# Altium schematic sheet Nixie_Embedded_Controller.SchDoc
size A4
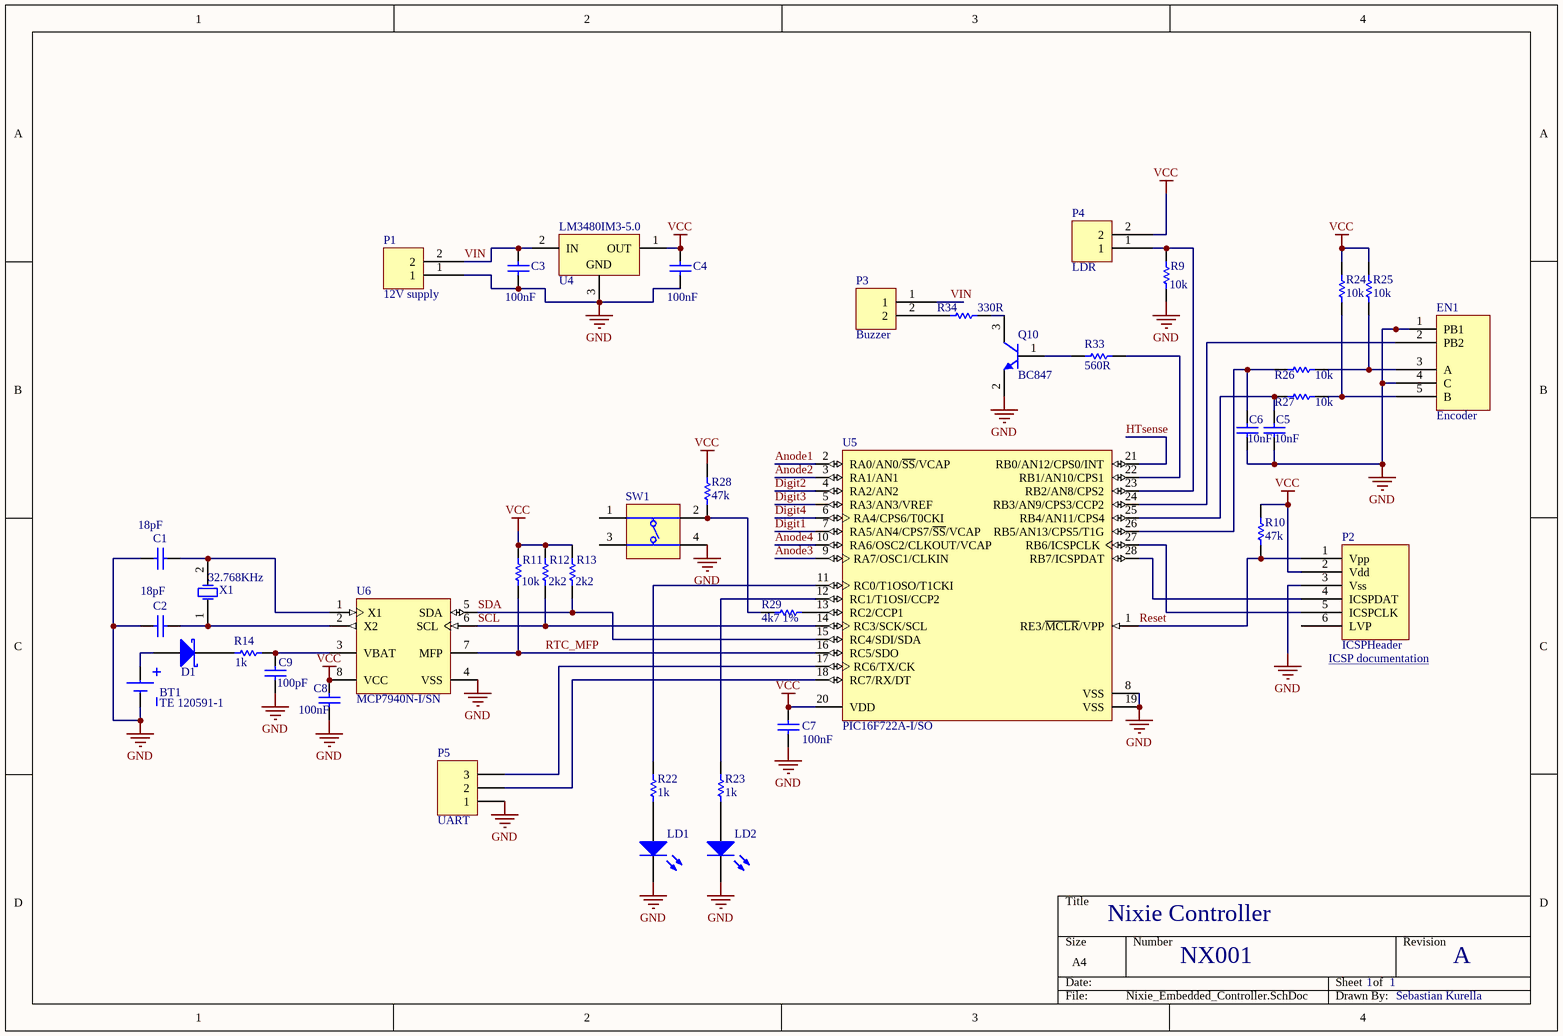
[diagram p0: Nixie_Embedded_Controller.SchDoc]

## Parts
BT1  TE 120591-1  [TE-120591-1]
C1  value 18pF  [CAPC0805(2012)100_M]  (hidden comment: CAP 18pF 16V 0805(2012))
C2  value 18pF  [CAPC0805(2012)100_M]  (hidden comment: CAP 18pF 16V 0805(2012))
C3  value 100nF  [CAPC0805(2012)100_M]  (hidden comment: CAP 100nF 16V 0805(2012))
C4  value 100nF  [CAPC0805(2012)100_M]  (hidden comment: CAP 100nF 16V 0805(2012))
C5  10nF  [CAPC0805(2012)100_M]
C6  10nF  [CAPC0805(2012)100_M]
C7  value 100nF  [CAPC0805(2012)100_M]  (hidden comment: CAP 100nF 10V 0805(2012))
C8  value 100nF  [CAPC0805(2012)100_M]  (hidden comment: CAP 100nF 10V 0805(2012))
C9  value 100pF  [CAPC0805(2012)100_M]  (hidden comment: CAP 100pF 10V 0805(2012))
D1  Schottky  [SOD-123]  (value not drawn)
EN1  Encoder  [BOURNS_PEC12R_ENCODER]
LD1  150080GS75000  [0805_A]  (value not drawn)
LD2  150080RS75000  [0805_A]  (value not drawn)
P1  12V supply  [2pos terminal block 3.5mm]
P2  ICSPHeader  [ICSPHDR]
P3  Buzzer  [2pos terminal block 3.5mm]
P4  LDR  [Header 1x2]
P5  UART  [HDR1X3]
Q10  BC847  [ONSC-SOT-23-3-318-08_V]
R9  value 10k  [RESC0805(2012)_M]  (hidden comment: 10K 5% 0805(2012))
R10  value 47k  [RESC0805(2012)_M]  (hidden comment: 47K 5% 0805(2012))
R11  value 10k  [RESC0805(2012)_M]  (hidden comment: 10K 5% 0805(2012))
R12  value 2k2  [RESC0805(2012)_M]  (hidden comment: 2K2 5% 0805(2012))
R13  value 2k2  [RESC0805(2012)_M]  (hidden comment: 2K2 5% 0805(2012))
R14  value 1k  [RESC0805(2012)_M]  (hidden comment: 1K 5% 0805(2012))
R22  1k  [RESC0805(2012)_M]
R23  1k  [RESC0805(2012)_M]
R24  10k  [RESC0805(2012)_M]
R25  10k  [RESC0805(2012)_M]
R26  10k  [RESC0805(2012)_M]
R27  10k  [RESC0805(2012)_M]
R28  47k  [RESC0805(2012)_L]
R29  4k7 1%  [RESC0805(2012)_M]
R33  560R  [RESC0805(2012)_M]
R34  330R  [RESC0805(2012)_M]
SW1  DTSM-61NT/R  [DIPT-DTSM-6_V]  (value not drawn)
U4  LM3480IM3-5.0  [MF03A_N]
U5  PIC16F722A-I/SO  [MCHP-SOIC-SO28_M]
U6  MCP7940N-I/SN  [SOIC-SN8_M]
X1  32.768KHz  [ABRA-ABS07-2_V]

## Nets
GND: BT1.2(-) C1.1 C2.1 C3.1 C4.1 C5.1 C6.1 C7.1 C8.1 C9.1 EN1.1(PB1) EN1.4(C) LD1.1(K) LD2.1(K) P1.1 P2.3(Vss) P5.1 Q10.2(E) R9.1 SW1.4(T3) U4.3(GND) U5.8(VSS) U5.19(VSS) U6.4(VSS)
VCC: C4.2 C7.2 C8.2 P2.2(Vdd) P4.2 R10.2 R11.2 R12.2 R13.2 R24.2 R25.2 R28.2 U4.1(OUT) U5.20(VDD) U6.8(VCC)
Anode1: U5.2(RA0/AN0/~{SS}/VCAP)
Anode2: U5.3(RA1/AN1)
Anode3: U5.9(RA7/OSC1/CLKIN)
Anode4: U5.10(RA6/OSC2/CLKOUT/VCAP)
Digit1: U5.7(RA5/AN4/CPS7/~{SS}/VCAP)
Digit2: U5.4(RA2/AN2)
Digit3: U5.5(RA3/AN3/VREF)
Digit4: U5.6(RA4/CPS6/T0CKI)
HTsense: U5.21(RB0/AN12/CPS0/INT)
Reset: P2.1(Vpp) R10.1 U5.1(RE3/~{MCLR}/VPP)
RTC_MFP: R11.1 U5.16(RC5/SDO) U6.7(MFP)
SCL: R12.1 U5.14(RC3/SCK/SCL) U6.6(SCL)
SDA: R13.1 U5.15(RC4/SDI/SDA) U6.5(SDA)
VIN: C3.2 P1.2 P3.1 U4.2(IN)
NetBT1_1: BT1.1(+) D1.1(A)
NetC1_2: C1.2 U6.1(X1) X1.2(X2)
NetC2_2: C2.2 U6.2(X2) X1.1(X1)
NetC5_2: C5.2 R27.2 U5.25(RB4/AN11/CPS4)
NetC6_2: C6.2 R26.2 U5.26(RB5/AN13/CPS5/T1G)
NetC9_2: C9.2 R14.2 U6.3(VBAT)
NetD1_2: D1.2(K) R14.1
NetEN1_2: EN1.2(PB2) U5.24(RB3/AN9/CPS3/CCP2)
NetEN1_3: EN1.3(A) R25.1 R26.1
NetEN1_5: EN1.5(B) R24.1 R27.1
NetLD1_2: LD1.2(A) R22.1
NetLD2_2: LD2.2(A) R23.1
NetP2_4: P2.4(ICSPDAT) U5.28(RB7/ICSPDAT)
NetP2_5: P2.5(ICSPCLK) U5.27(RB6/ICSPCLK)
NetP3_2: P3.2 R34.1
NetP4_1: P4.1 R9.2 U5.23(RB2/AN8/CPS2)
NetP5_2: P5.2 U5.18(RC7/RX/DT)
NetP5_3: P5.3 U5.17(RC6/TX/CK)
NetQ10_1: Q10.1(B) R33.1
NetQ10_3: Q10.3(C) R34.2
NetR22_2: R22.2 U5.11(RC0/T1OSO/T1CKI)
NetR23_2: R23.2 U5.12(RC1/T1OSI/CCP2)
NetR28_1: R28.1 R29.2 SW1.2(T2)
NetR29_1: R29.1 U5.13(RC2/CCP1)
NetR33_2: R33.2 U5.22(RB1/AN10/CPS1)

Not connected (* = marked no-connect by the designer): P2 6(LVP); SW1 1(T1) 3(T3)

## Notes on the sheet
- (near P2) ICSP documentation <http://ww1.microchip.com/downloads/en/DeviceDoc/PICkit_3_User_Guide_51795A.pdf#page=15>
- Nixie Controller
- NX001
- 1
- A
- Sebastian Kurella

## Library data of the parts
BT1 = TECO-120591-1-2: pin to pad: 2>3
C1 C2 = CMP-1036-01121-1: CAP 18pF 16V ±5% 0805 (2012 Metric) Thickness 1mm SMD; Case-Metric: 2012; Case-EIA: 0805; Tolerance: ±5%; Rated Voltage: 16 V; Max Thickness: 1 mm; Technology: SMT
C3 C4 = CMP-1036-04405-1: CAP 100nF 16V ±20% 0805 (2012 Metric) Thickness 1mm SMD; Case-EIA: 0805; Case-Metric: 2012; Tolerance: ±20%; Max Thickness: 1 mm; Rated Voltage: 16 V; Technology: SMT
C5 C6 = CMP-1036-03820-1: CAP 10nF 16V ±10% 0805 (2012 Metric) Thickness 1mm SMD; Case-Metric: 2012; Case-EIA: 0805; Rated Voltage: 16 V; Tolerance: ±10%; Value: 10nF; Technology: SMT; Max Thickness: 1 mm
C7 C8 = CMP-1036-04393-1: CAP 100nF 10V ±5% 0805 (2012 Metric) Thickness 1mm SMD; Case-EIA: 0805; Case-Metric: 2012; Rated Voltage: 10 V; Tolerance: ±5%; Technology: SMT; Max Thickness: 1 mm
C9 = CMP-1036-01930-1: CAP 100pF 10V ±2% 0805 (2012 Metric) Thickness 1mm SMD; Case-EIA: 0805; Case-Metric: 2012; Technology: SMT; Max Thickness: 1 mm; Rated Voltage: 10 V; Tolerance: ±2%
LD1 = CMP-1426-00007-1: SMD mono-color Chip LED, WL-SMCW, Green; Manufacturer: Wuerth Elektronik; PackageReference: 0805_A; Color: Green; PartNumber: 150080GS75000; ComponentLink2URL: http://katalog.we-online.com/led/datasheet/150080GS75000.pdf; ComponentLink1URL: http://www.we-online.com; ComponentLink1Description: Manufacturer URL; ComponentLink2Description: Datasheet
LD2 = CMP-1426-00011-1: SMD mono-color Chip LED, WL-SMCW, Red; Manufacturer: Wuerth Elektronik; Color: Red; PartNumber: 150080RS75000; PackageReference: 0805_A; ComponentLink2Description: Datasheet; ComponentLink1URL: http://www.we-online.com; ComponentLink1Description: Manufacturer URL; ComponentLink2URL: http://katalog.we-online.com/led/datasheet/150080RS75000.pdf
P1 P3 = 2pos terminal block 3.5mm: TE 1776275-2
P4 = Header 1x2: TE 640456-2
P5 = Header 3: Header, 3-Pin; LatestRevisionDate: 17-Jul-2002; LatestRevisionNote: Re-released for DXP Platform.; Publisher: Altium Limited
Q10 = CMP-1048-00018-1: General Purpose Transistor, NPN Silicon, 3-Pin SOT-23, Tape and Reel; Manufacturer: On Semiconductor; PartNumber: BC847ALT1; fT Min (MHz): 100; IC Continuous (A): 0.1; ComponentLink3URL: http://www.onsemi.cn/pub_link/Collateral/318-08.PDF; PackageVersion: Rev. AP, 11/2009; DatasheetVersion: Rev. 11; ComponentLink1Description: Manufacturer URL; ComponentLink1URL: http://www.onsemi.com/; ComponentLink2Description: Datasheet; RoHS: FALSE; PackageDescription: 3-Pin Small Outline Transistor, Body 2.92 x 1.3 mm, Pitch 0.95 mm; Packing: Tape and Reel; ComponentLink3Description: Package Specification; Polarity: NPN; ComponentLink2URL: http://www.onsemi.cn/pub_link/Collateral/BC846ALT1-D.PDF; PackageReference: SOT-23-3-318-08; Mounting Technology: Surface Mount
R9 R11 = CMP-1013-00098-1: 10K 0.125W 5% 0805 (2012 Metric)  SMD; Case-EIA: 0805; Case-Metric: 2012; Power: 0.125 W; Technology: SMT; Tolerance: 5 %
R10 = CMP-1013-00114-1: 47K 0.125W 5% 0805 (2012 Metric)  SMD; Case-Metric: 2012; Case-EIA: 0805; Tolerance: 5 %; Power: 0.125 W; Technology: SMT
R12 R13 = CMP-1013-00082-1: 2K2 0.125W 5% 0805 (2012 Metric)  SMD; Case-EIA: 0805; Case-Metric: 2012; Power: 0.125 W; Tolerance: 5 %; Technology: SMT
R14 = CMP-1013-00074-1: 1K 0.125W 5% 0805 (2012 Metric)  SMD; Case-EIA: 0805; Case-Metric: 2012; Technology: SMT; Power: 0.125 W; Tolerance: 5 %
R22 R23 = CMP-1013-00074-1: 1K 0.125W 5% 0805 (2012 Metric)  SMD; Case-EIA: 0805; Case-Metric: 2012; Value: 1000.00 Ohm; Technology: SMT; Power: 0.125 W; Tolerance: 5 %
R24-R27 = CMP-1013-00098-1: 10K 0.125W 5% 0805 (2012 Metric)  SMD; Case-EIA: 0805; Case-Metric: 2012; Value: 10000.00 Ohm; Power: 0.125 W; Technology: SMT; Tolerance: 5 %
R28 = CMP-1013-00114-1: 47K 0.125W 5% 0805 (2012 Metric)  SMD; Case-Metric: 2012; Case-EIA: 0805; Value: 47000.00 Ohm; Tolerance: 5 %; Power: 0.125 W; Technology: SMT
R29 = CMP-1013-00586-1: 4K7 0.125W 1% 0805 (2012 Metric)  SMD; Case-Metric: 2012; Case-EIA: 0805; Value: 4700.00 Ohm; Technology: SMT; Power: 0.125 W; Tolerance: 1 %
R33 = CMP-1013-00068-1: 560R 0.125W 5% 0805 (2012 Metric)  SMD; Case-Metric: 2012; Value: 560.00 Ohm; Case-EIA: 0805; Power: 0.125 W; Technology: SMT; Tolerance: 5 %
R34 = CMP-1013-00062-1: 330R 0.125W 5% 0805 (2012 Metric)  SMD; Value: 330.00 Ohm; Case-EIA: 0805; Case-Metric: 2012; Tolerance: 5 %; Power: 0.125 W; Technology: SMT
SW1 = CMP-0306-00001-1: Switch, SPNO Push Button SMD; Manufacturer: Diptronics; Packing Type: Tape&Reel; Mechanical Life: 200,000 cycles; ComponentLink2URL: http://www.dip.com.tw/Products_tact.htm; ComponentLink1URL: http://www.dip.com.tw/; ComponentLink3URL: http://www.dip.com.tw/PDF/pro_tact/DTSM_G_-6_2_-V.pdf; PackageDescription: Switch, Through-Hole, 4 Leads, Body 8.5x8.5mm, Row Spacing 9.0mm, Pitch 4.5mm; ComponentLink2Description: Datasheet; ComponentLink3Description: Package Specification; ComponentLink1Description: Manufacturer URL; PackageReference: DTSM-6; PartNumber: DTSM-61NT/R; Mounting Technology: Through Hole
U4 = CMP-0062-02200-1: 100 mA, Quasi Low-Dropout Linear Voltage Regulator, 3-pin SOT-23, Pb-Free; Manufacturer: National Semiconductor; PackageTopMarking: L0B*XTT; PowerWise: N; CompType: LDO IC; PackageDescription: Molded SOT-23, .115 x .051 x .037in Body, 3 Lead, .075 in Pitch; PackageReference: MF03A; PinCount: 3; PackageVersion: revB, Mar-2003; RoHS: Y; DatasheetVersion: Mar-2005
U5 = CMP-0115-02602-1: Flash Microcontroller with nanoWatt XLP Technology, 20 MHz, 24 I/O, -40 to 85 degC, 28-pin SOIC (SO28), Tube; Manufacturer: Microchip; I/O Pins: 24; # of A/D Channels: 11; Digital Communication: 1 -A/E/USART, 1 -SSP(SPI/I2C); RAM: 128; Max. CPU Speed MHz: 20; Program Memory KWords: 2; Program Memory KBytes: 3.5; Internal Oscillator: 16 MHz, 500 kHz; Operation Voltage Range: 1.8V - 5.5V; Timers: 2 - 8-bit, 1 - 16-bit, 0 - 32-bit; ComponentLink2Description: Package Specification; ComponentLink2URL: http://www.microchip.com/stellent/groups/techpub_sg/documents/packagingspec/en012702.pdf; PartNumber: PIC16F722A-I/SO; ComponentLink3Description: URL Link1; Memory Type: Flash; PackageReference: SOIC-SO28; PackageVersion: C04-052C, 12/2012; ComponentLink3URL: Product URL:http://www.microchip.com/datasheet/PIC16F722A; ComponentLink1Description: Datasheet; ComponentLink1URL: http://ww1.microchip.com/downloads/en/DeviceDoc/41417B.pdf; Packing: TUBE; Mounting Technology: Surface Mount; RoHS: TRUE; DatasheetVersion: Rev. B; PackageDescription: 28-Lead Plastic Small Outline, 17.9 x 7.5 mm Body, 1.27 mm Pitch
U6 = CMP-0186-00196-1: Low-Cost I2C Real-Time Clock/Calendar with SRAM and Battery Switchover, 8-Pin SOIC, Industrial Temperature; PackageDescription: 8-Lead Plastic Small Outline (SN) - Narrow, 3.90mm Body [SOIC]; Code_JEDEC: MS-012; ComponentLink2Description: Datasheet; DatasheetVersion: revC, Dec-2011; ComponentLink3Description: Package Specification; ComponentLink2URL: http://ww1.microchip.com/downloads/en/DeviceDoc/25010C.pdf; PackageVersion: revBB, Aug-2009; ComponentLink3URL: http://www.microchip.com/stellent/groups/techpub_sg/documents/packagingspec/en012702.pdf; ComponentLink1URL: http://www.microchip.com/; ComponentLink1Description: Manufacturer URL; Code_IPC: SOIC127P600-8; PackageReference: SOIC-SN8; Supplier 1: Farnell; Supplier Part Number 1: 2361122
X1 = CMP-0447-00001-1: Crystal, 32.768 kHz, 12.5 pF, -40 to 85 degC, SMD Low Profile 3.2 x 1.5 x 0.9 mm, Tape and Reel; PartNumber: ABS07-32.768KHz-T; Manufacturer: Abracon; Drive Level (Type): 0.1 uW; Operation Mode: Flexural Mode (Tuning Fork); Shunt Capacitance (C0): 0.9 to 1.2 pF; Equivalent Series Resistance (R1): 70 Kohm; Insulation Resistance (Min): 500 Mohm; Q Value (Type): 30000; Frequency Tolerance @+25degC: +/- 20 ppm; Load Capacitance (CL): 12.5 pF; Operating Temperature: -40 to 85 degC; ComponentLink3Description: Package Specification; DatasheetVersion: 04.03.13; Mounting Technology: Surface Mount; Frequency: 32.768 kHz; ComponentLink1URL: http://www.abracon.com/; Packing: Tape and Reel; ComponentLink3URL: http://www.abracon.com/Resonators/ABS07.pdf; ComponentLink2Description: Datasheet; PackageDescription: 2-Pin Hand Drawn, Body 3.2x1.5mm, Pitch 2.5mm; ComponentLink1Description: Manufacturer URL; PackageReference: ABS07-2; ComponentLink2URL: http://www.abracon.com/Resonators/ABS07.pdf
P2 = ICSPHeader: ComponentLink1Description: Documentation; ComponentLink1URL: http://ww1.microchip.com/downloads/en/DeviceDoc/PICkit_3_User_Guide_51795A.pdf#page=15